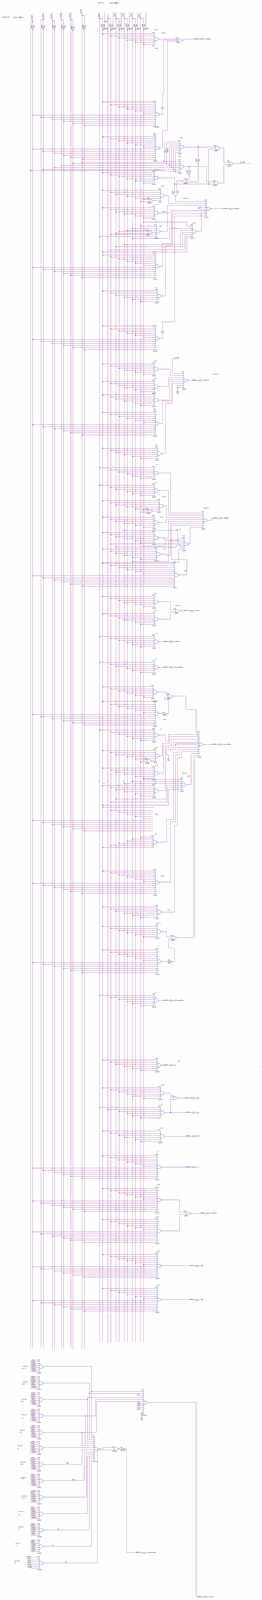
[diagram p0: schematic sheet, whole]
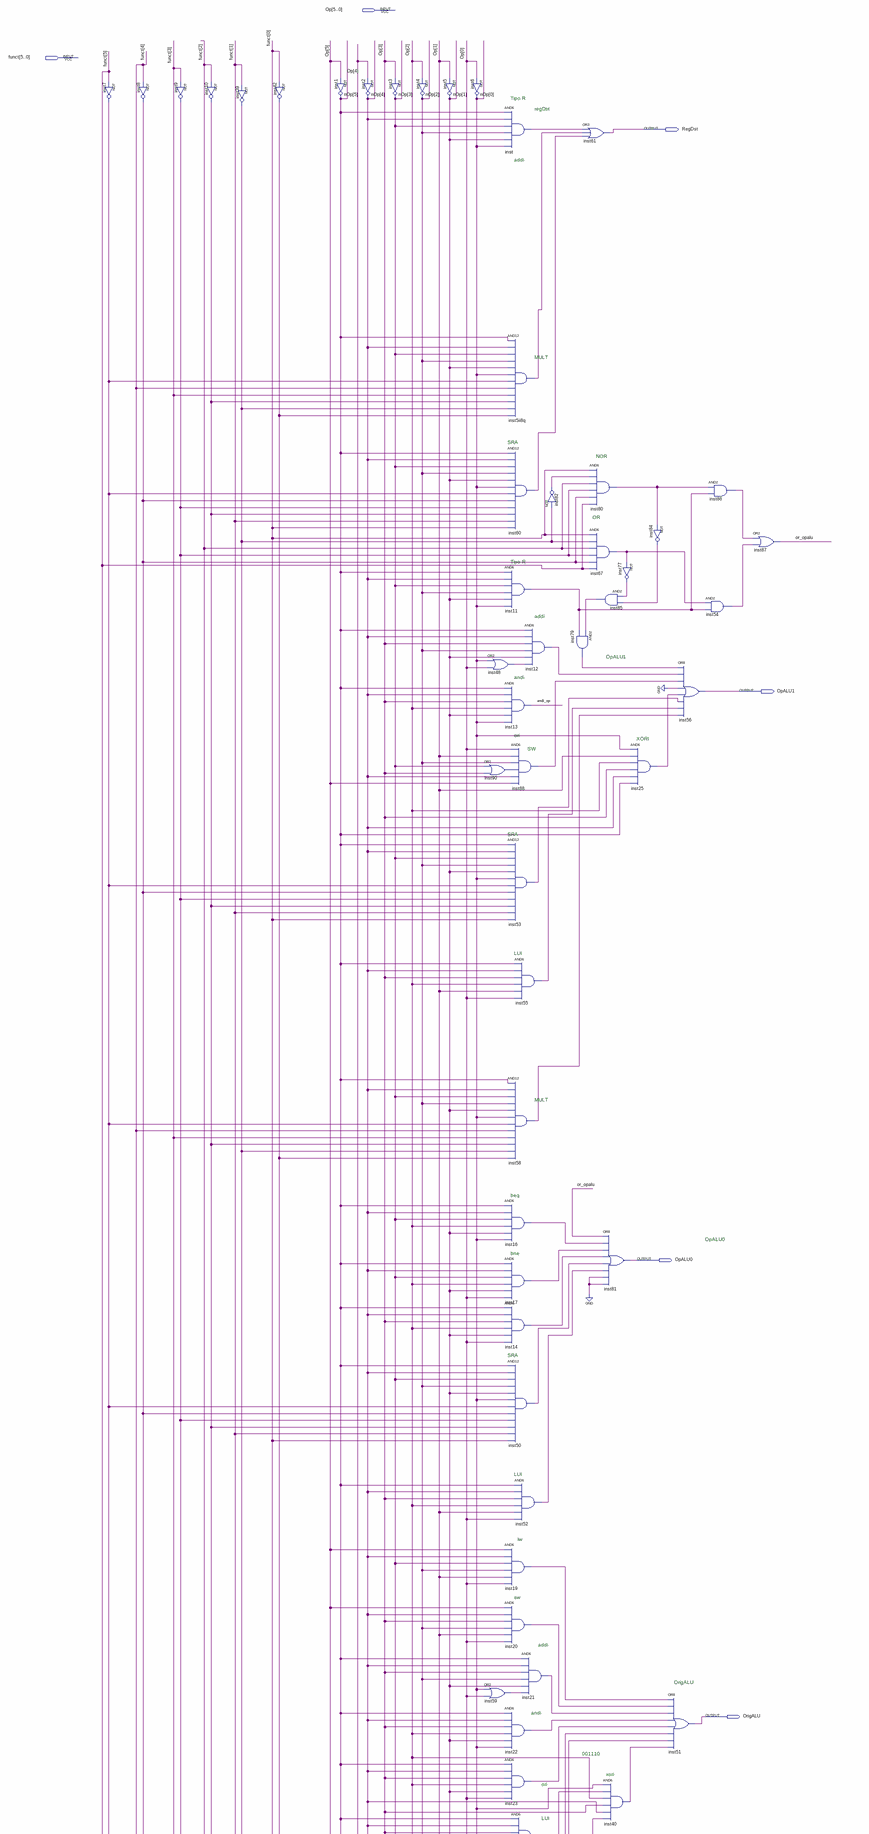
[diagram p1: schematic sheet, upper part]
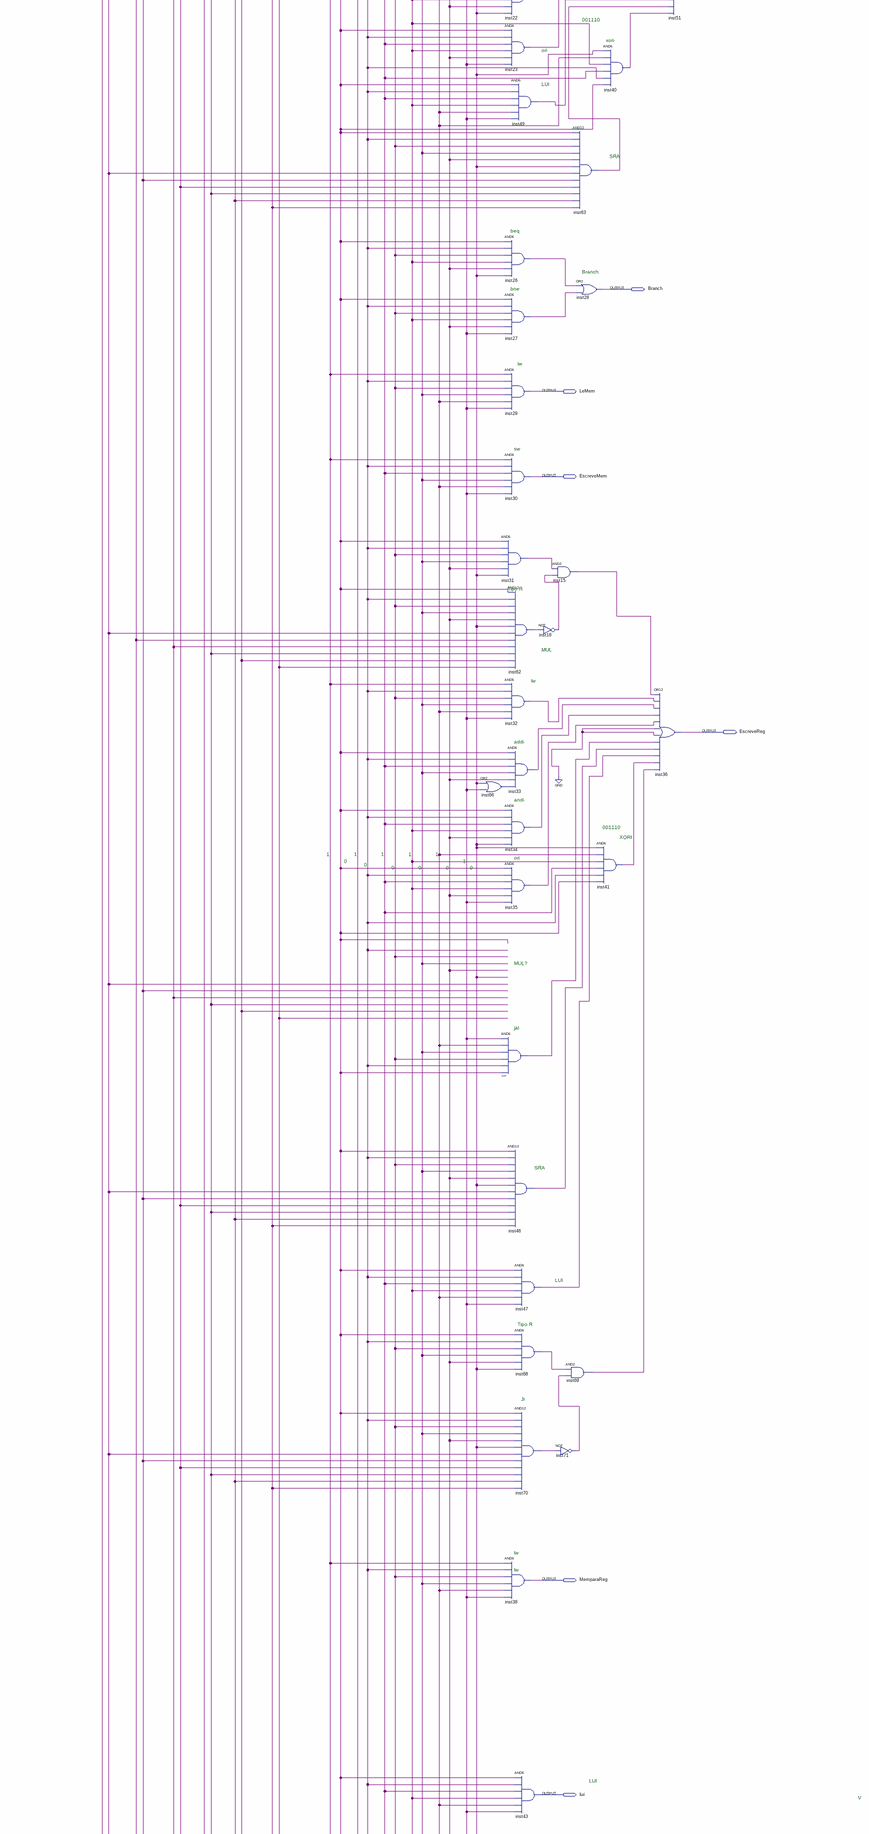
[diagram p2: schematic sheet, middle part]
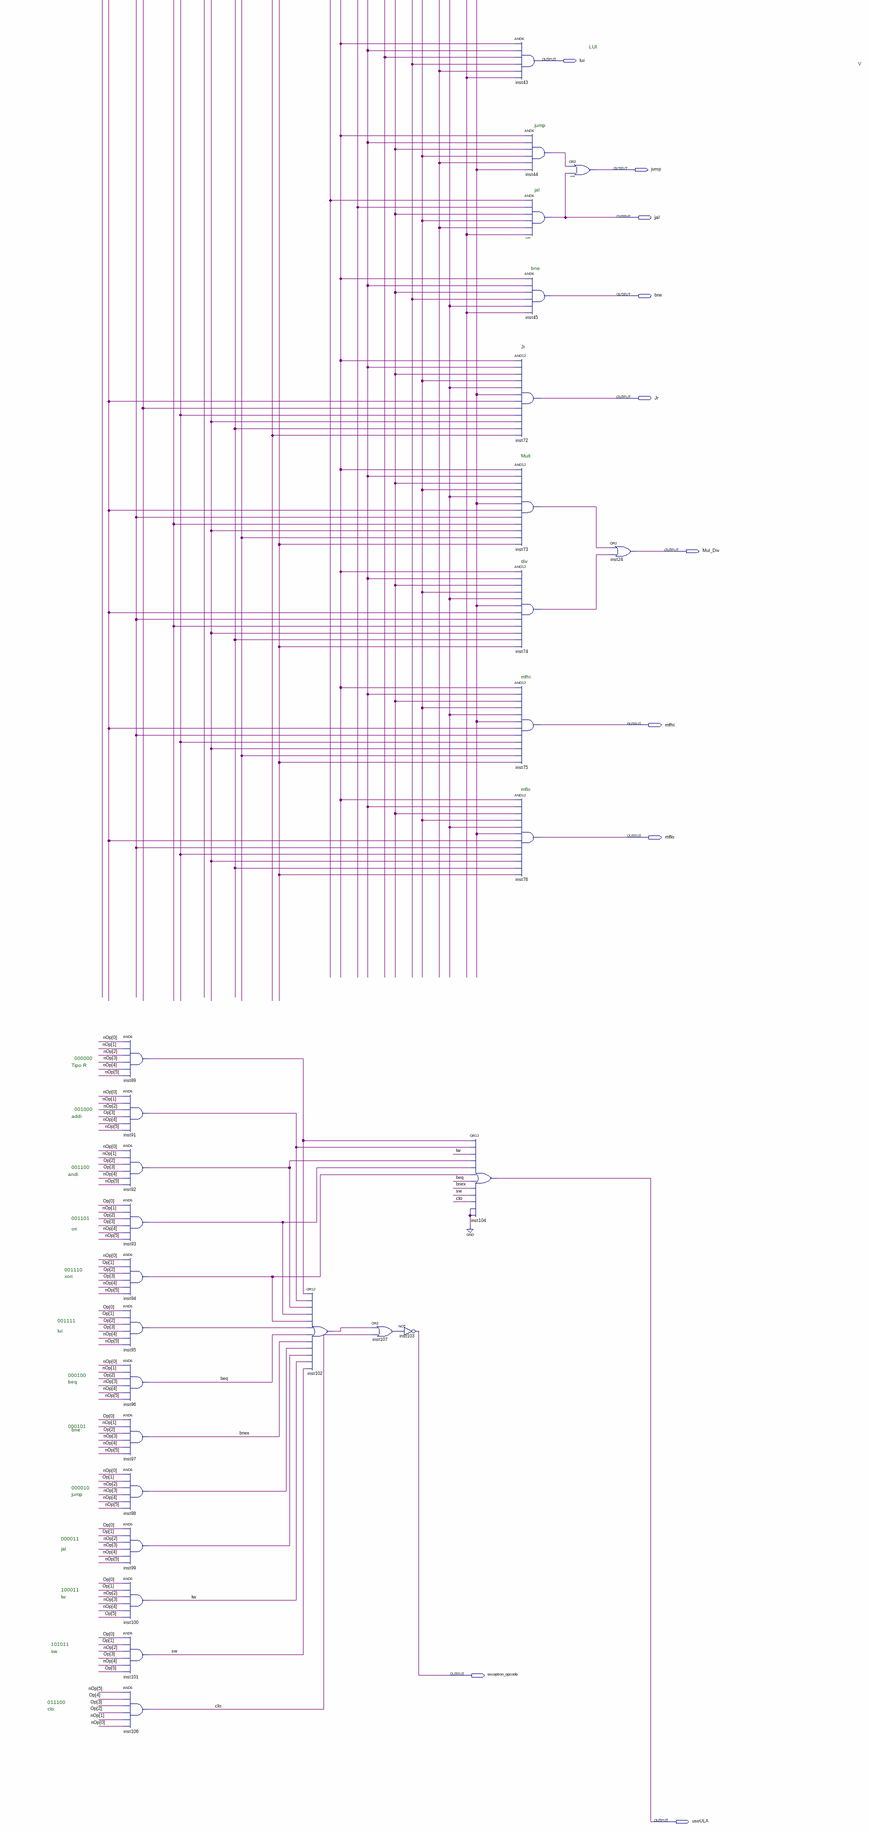
[diagram p3: schematic sheet, lower part]
// Quartus schematic controlepipe2.bdf as structural Verilog: 105 symbols, 21 pins
module controlepipe2 (
  input  [5:0] Op,
  input  [5:0] funct,
  output RegDst,
  output OpALU1,
  output OpALU0,
  output OrigALU,
  output Branch,
  output LeMem,
  output EscreveMem,
  output EscreveReg,
  output MemparaReg,
  output lui,
  output jump,
  output jal,
  output bne,
  output Jr,
  output Mul_Div,
  output mfhi,
  output mflo,
  output exception_opcode,
  output useULA
);

  wire andi_op, beq, bnex, clo, inst5ii8q_out, inst7_out, inst8_out, inst9_out, inst10_out, inst11_out,
       inst12_out, inst14_out, inst15_out, inst16_out, inst17_out, inst18_out, inst19_out, inst20_out,
       inst21_out, inst22_out, inst23_out, inst25_out, inst26_out, inst27_out, inst31_out, inst32_out,
       inst33_out, inst34_out, inst35_out, inst39_out, inst40_out, inst41_out, inst42_out, inst44_out,
       inst46_out, inst47_out, inst48_out, inst49_out, inst50_out, inst52_out, inst53_out, inst54_out,
       inst55_out, inst57_out, inst58_out, inst59_out, inst60_out, inst62_out, inst63_out, inst66_out,
       inst67_out, inst68_out, inst69_out, inst70_out, inst71_out, inst73_out, inst74_out, inst77_out,
       inst79_out, inst80_out, inst82_out, inst84_out, inst85_out, inst86_out, inst88_out, inst89_out,
       inst90_out, inst91_out, inst92_out, inst93_out, inst94_out, inst95_out, inst98_out, inst99_out,
       inst102_out, inst107_out, inst_out, lw, or_opalu, sw;
  wire [5:0] nOp;

  not inst7 (inst7_out, funct[5]);
  not inst8 (inst8_out, funct[4]);
  and inst89 (inst89_out, nOp[0], nOp[1], nOp[2], nOp[3], nOp[4], nOp[5]);
  and inst91 (inst91_out, nOp[0], nOp[1], nOp[2], Op[3], nOp[4], nOp[5]);
  and inst92 (inst92_out, nOp[0], nOp[1], Op[2], Op[3], nOp[4], nOp[5]);
  and inst93 (inst93_out, Op[0], nOp[1], Op[2], Op[3], nOp[4], nOp[5]);
  and inst94 (inst94_out, nOp[0], Op[1], Op[2], Op[3], nOp[4], nOp[5]);
  and inst95 (inst95_out, Op[0], Op[1], Op[2], Op[3], nOp[4], nOp[5]);
  and inst96 (beq, nOp[0], nOp[1], Op[2], nOp[3], nOp[4], nOp[5]);
  and inst97 (bnex, Op[0], nOp[1], Op[2], nOp[3], nOp[4], nOp[5]);
  and inst98 (inst98_out, nOp[0], Op[1], nOp[2], nOp[3], nOp[4], nOp[5]);
  and inst99 (inst99_out, Op[0], Op[1], nOp[2], nOp[3], nOp[4], nOp[5]);
  and inst100 (lw, Op[0], Op[1], nOp[2], nOp[3], nOp[4], Op[5]);
  and inst101 (sw, Op[0], Op[1], nOp[2], Op[3], nOp[4], Op[5]);
  and inst106 (clo, nOp[5], Op[4], Op[3], Op[2], nOp[1], nOp[0]);
  not inst9 (inst9_out, funct[3]);
  not inst10 (inst10_out, funct[2]);
  not inst39 (inst39_out, funct[1]);
  not inst42 (inst42_out, funct[0]);
  or inst102 (inst102_out, inst89_out, inst91_out, inst92_out, inst93_out, inst94_out, inst95_out, beq, bnex, inst98_out, inst99_out, lw, sw);
  not inst1 (nOp[5], Op[5]);
  not inst2 (nOp[4], Op[4]);
  or inst107 (inst107_out, inst102_out, clo);
  not inst3 (nOp[3], Op[3]);
  not inst103 (exception_opcode, inst107_out);
  not inst4 (nOp[2], Op[2]);
  not inst5 (nOp[1], Op[1]);
  not inst6 (nOp[0], Op[0]);
  or inst48 (inst48_out, nOp[0], Op[0]);
  or inst90 (inst90_out, nOp[3], Op[3]);
  or inst59 (inst59_out, nOp[0], Op[0]);
  or inst66 (inst66_out, nOp[0], Op[0]);
  or inst104 (useULA, inst89_out, inst91_out, lw, inst92_out, inst93_out, inst94_out, beq, bnex, sw, clo, 1'b0, 1'b0);
  and inst (inst_out, nOp[5], nOp[4], nOp[3], nOp[2], nOp[1], nOp[0]);
  and inst5ii8q (inst5ii8q_out, nOp[5], nOp[4], nOp[3], nOp[2], nOp[1], nOp[0], inst7_out, funct[4], funct[3], inst10_out, inst39_out, inst42_out);
  and inst60 (inst60_out, nOp[5], nOp[4], nOp[3], nOp[2], nOp[1], nOp[0], inst7_out, inst8_out, inst9_out, inst10_out, funct[1], funct[0]);
  and inst11 (inst11_out, nOp[5], nOp[4], nOp[3], nOp[2], nOp[1], nOp[0]);
  and inst13 (andi_op, nOp[5], nOp[4], Op[3], Op[2], nOp[1], nOp[0]);
  and inst88 (inst88_out, Op[0], Op[1], nOp[2], inst90_out, nOp[4], Op[5]);
  and inst53 (inst53_out, nOp[5], nOp[4], nOp[3], nOp[2], nOp[1], nOp[0], inst7_out, inst8_out, inst9_out, inst10_out, funct[1], funct[0]);
  and inst55 (inst55_out, nOp[5], nOp[4], Op[3], Op[2], Op[1], Op[0]);
  and inst58 (inst58_out, nOp[5], nOp[4], nOp[3], nOp[2], nOp[1], nOp[0], inst7_out, funct[4], funct[3], inst10_out, inst39_out, inst42_out);
  and inst16 (inst16_out, nOp[5], nOp[4], nOp[3], Op[2], nOp[1], nOp[0]);
  and inst17 (inst17_out, nOp[5], nOp[4], nOp[3], Op[2], nOp[1], Op[0]);
  and inst14 (inst14_out, nOp[5], nOp[4], Op[3], Op[2], nOp[1], Op[0]);
  and inst50 (inst50_out, nOp[5], nOp[4], nOp[3], nOp[2], nOp[1], nOp[0], inst7_out, inst8_out, inst9_out, inst10_out, funct[1], funct[0]);
  and inst52 (inst52_out, nOp[5], nOp[4], Op[3], Op[2], Op[1], Op[0]);
  and inst19 (inst19_out, Op[5], nOp[4], nOp[3], nOp[2], Op[1], Op[0]);
  and inst20 (inst20_out, Op[5], nOp[4], Op[3], nOp[2], Op[1], Op[0]);
  and inst22 (inst22_out, nOp[5], nOp[4], Op[3], Op[2], nOp[1], nOp[0]);
  and inst23 (inst23_out, nOp[5], nOp[4], Op[3], Op[2], nOp[1], Op[0]);
  and inst49 (inst49_out, nOp[5], nOp[4], Op[3], Op[2], Op[1], Op[0]);
  and inst26 (inst26_out, nOp[5], nOp[4], nOp[3], Op[2], nOp[1], nOp[0]);
  and inst27 (inst27_out, nOp[5], nOp[4], nOp[3], Op[2], nOp[1], Op[0]);
  and inst29 (LeMem, Op[5], nOp[4], nOp[3], nOp[2], Op[1], Op[0]);
  and inst30 (EscreveMem, Op[5], nOp[4], Op[3], nOp[2], Op[1], Op[0]);
  and inst31 (inst31_out, nOp[5], nOp[4], nOp[3], nOp[2], nOp[1], nOp[0]);
  and inst62 (inst62_out, nOp[5], nOp[4], nOp[3], nOp[2], nOp[1], nOp[0], inst7_out, funct[4], funct[3], inst10_out, inst39_out, inst42_out);
  and inst32 (inst32_out, Op[5], nOp[4], nOp[3], nOp[2], Op[1], Op[0]);
  and inst33 (inst33_out, nOp[5], nOp[4], Op[3], nOp[2], nOp[1], inst66_out);
  and inst34 (inst34_out, nOp[5], nOp[4], Op[3], Op[2], nOp[1], nOp[0]);
  and inst35 (inst35_out, nOp[5], nOp[4], Op[3], Op[2], nOp[1], Op[0]);
  and inst57 (inst57_out, Op[0], Op[1], nOp[2], nOp[3], nOp[4], nOp[5]);
  and inst46 (inst46_out, nOp[5], nOp[4], nOp[3], nOp[2], nOp[1], nOp[0], inst7_out, inst8_out, inst9_out, inst10_out, funct[1], funct[0]);
  and inst47 (inst47_out, nOp[5], nOp[4], Op[3], Op[2], Op[1], Op[0]);
  and inst68 (inst68_out, nOp[5], nOp[4], nOp[3], nOp[2], nOp[1], nOp[0]);
  and inst70 (inst70_out, nOp[5], nOp[4], nOp[3], nOp[2], nOp[1], nOp[0], inst7_out, inst8_out, inst9_out, inst10_out, funct[1], funct[0]);
  and inst38 (MemparaReg, Op[5], nOp[4], nOp[3], nOp[2], Op[1], Op[0]);
  and inst43 (lui, nOp[5], nOp[4], Op[3], Op[2], Op[1], Op[0]);
  and inst72 (Jr, nOp[5], nOp[4], nOp[3], nOp[2], nOp[1], nOp[0], inst7_out, inst8_out, inst9_out, inst10_out, funct[1], funct[0]);
  and inst73 (inst73_out, nOp[5], nOp[4], nOp[3], nOp[2], nOp[1], nOp[0], inst7_out, funct[4], funct[3], inst10_out, inst39_out, inst42_out);
  and inst74 (inst74_out, nOp[5], nOp[4], nOp[3], nOp[2], nOp[1], nOp[0], inst7_out, funct[4], funct[3], inst10_out, funct[1], inst42_out);
  and inst75 (mfhi, nOp[5], nOp[4], nOp[3], nOp[2], nOp[1], nOp[0], inst7_out, funct[4], inst9_out, inst10_out, inst39_out, inst42_out);
  and inst76 (mflo, nOp[5], nOp[4], nOp[3], nOp[2], nOp[1], nOp[0], inst7_out, funct[4], inst9_out, inst10_out, funct[1], inst42_out);
  not inst82 (inst82_out, inst39_out);
  and inst12 (inst12_out, nOp[5], nOp[4], Op[3], nOp[2], nOp[1], inst48_out);
  and inst21 (inst21_out, nOp[5], nOp[4], Op[3], nOp[2], nOp[1], inst59_out);
  not inst18 (inst18_out, inst62_out);
  and inst44 (inst44_out, nOp[5], nOp[4], nOp[3], nOp[2], Op[1], nOp[0]);
  and inst64 (jal, Op[5], Op[4], nOp[3], nOp[2], Op[1], Op[0]);
  and inst45 (bne, nOp[5], nOp[4], nOp[3], Op[2], nOp[1], Op[0]);
  and inst79 (inst79_out, inst85_out, inst11_out);
  and inst63 (inst63_out, nOp[5], nOp[4], nOp[3], nOp[2], nOp[1], nOp[0], inst7_out, inst8_out, inst9_out, inst10_out, funct[1], funct[0]);
  and inst15 (inst15_out, inst31_out, inst18_out);
  and inst69 (inst69_out, inst68_out, inst71_out);
  not inst71 (inst71_out, inst70_out);
  or inst65 (jump, inst44_out, jal);
  or inst61 (RegDst, inst_out, inst5ii8q_out, inst60_out);
  and inst80 (inst80_out, funct[0], inst82_out, funct[2], inst9_out, inst8_out, funct[5]);
  and inst67 (inst67_out, funct[0], inst39_out, funct[2], inst9_out, inst8_out, funct[5]);
  and inst85 (inst85_out, inst77_out, inst84_out);
  or inst28 (Branch, inst26_out, inst27_out);
  and inst41 (inst41_out, nOp[0], Op[1], Op[2], Op[3], nOp[4], nOp[5]);
  not inst77 (inst77_out, inst67_out);
  or inst81 (OpALU0, or_opalu, inst16_out, inst17_out, inst14_out, inst50_out, inst52_out, 1'b0, 1'b0);
  and inst40 (inst40_out, nOp[0], Op[1], Op[2], Op[3], nOp[4], nOp[5]);
  or inst24 (Mul_Div, inst73_out, inst74_out);
  not inst84 (inst84_out, inst80_out);
  and inst25 (inst25_out, nOp[0], Op[1], Op[2], Op[3], nOp[4], nOp[5]);
  or inst36 (EscreveReg, inst15_out, inst32_out, inst33_out, inst34_out, inst35_out, 1'b0, 1'b0, inst57_out, inst46_out, inst47_out, inst41_out, inst69_out);
  or inst56 (OpALU1, inst79_out, inst12_out, inst88_out, 1'b0, inst25_out, inst53_out, inst55_out, inst58_out);
  or inst51 (OrigALU, inst19_out, inst20_out, inst21_out, inst22_out, inst23_out, inst49_out, inst63_out, inst40_out);
  and inst86 (inst86_out, inst80_out, inst11_out);
  and inst54 (inst54_out, inst67_out, inst11_out);
  or inst87 (or_opalu, inst86_out, inst54_out);

  // Notes on the sheet:
  //   Tipo R
  //   regDst
  //   addi
  //   MULT
  //   SRA
  //   NOR
  //   OR
  //   Tipo R
  //   addi
  //   OpALU1
  //   andi
  //   ori
  //   XORI
  //   SW
  //   SRA
  //   LUI
  //   MULT
  //   beq
  //   OpALU0
  //   bne
  //   SRA
  //   LUI
  //   lw
  //   sw
  //   addi
  //   OrigALU
  //   andi
  //   001110
  //   xori
  //   ori
  //   LUI
  //   SRA
  //   beq
  //   Branch
  //   bne
  //   lw
  //   sw
  //   Tipo R
  //   MUL
  //   lw
  //   addi
  //   andi
  //   001110
  //   XORI
  //   1
  //   1
  //   1
  //   1
  //   1
  //   ori
  //   0
  //   1
  //   0
  //   0
  //   0
  //   0
  //   0
  //   MUL?
  //   jal
  //   SRA
  //   LUI
  //   Tipo R
  //   Jr
  //   lw
  //   lw
  //   LUI
  //   V
  //   jump
  //   jal
  //   bne
  //   Jr
  //   Mult
  //   div
  //   mfhi
  //   mflo
  //   000000
  //   Tipo R
  //   001000
  //   addi
  //   001100
  //   andi
  //   001101
  //   ori
  //   001110
  //   xori
  //   001111
  //   lui
  //   000100
  //   beq
  //   000101
  //   bne
  //   000010
  //   jump
  //   000011
  //   jal
  //   100011
  //   lw
  //   101011
  //   sw
  //   011100
  //   clo
endmodule
